# Altium schematic sheet GymkhanaStoper v1.6 Main.SchDoc
size A4; Organization: Altium Limited; Address1: L3, 12a Rodborough Rd; Address2: Frenchs Forest; Address3: NSW; Address4: Australia 2086
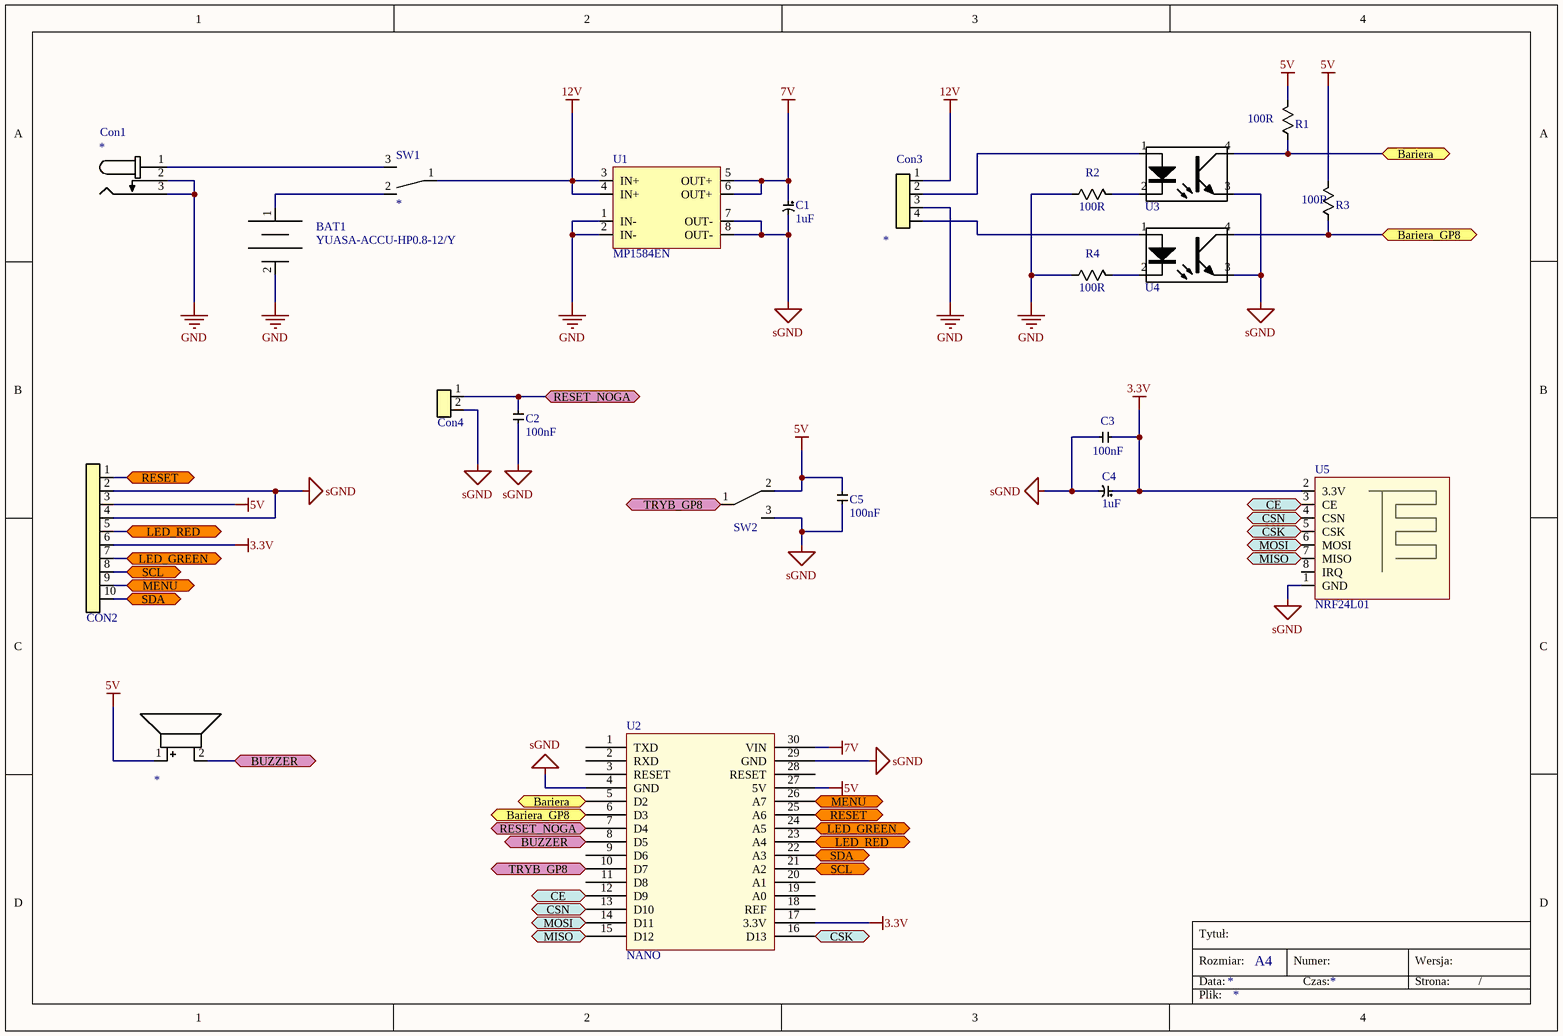
[diagram p0: GymkhanaStoper v1.6 Main.SchDoc]

## Parts
B1  *  [Buzzer F/CM12P]
BAT1  YUASA-ACCU-HP0.8-12/Y  [KK2_4mm_JST]
C1  Pojemność: 1uF  [8x10_SMD]  (hidden comment: *)
C2  Pojemność: 100nF  [0603-C]  (hidden comment: kondensator)
C3  Pojemność: 100nF  [0603-C]  (hidden comment: kondensator)
C4  Pojemność: 1uF  [8x10_SMD]  (hidden comment: *)
C5  Pojemność: 100nF  [0603-C]  (hidden comment: kondensator)
Con1  *  [PowerJack2.5_THT]
CON2  *  [IDC10_2.54mm_SMT]  (value not drawn)
Con3  *  [KK4_2.54mm 90DEG]
Con4  *  [KK2_4mm_JST]  (value not drawn)
R1  Rezystancja: 100R  [1206-R]  (hidden comment: rezystor)
R2  Rezystancja: 100R  [1206-R]  (hidden comment: rezystor)
R3  Rezystancja: 100R  [1206-R]  (hidden comment: rezystor)
R4  Rezystancja: 100R  [1206-R]  (hidden comment: rezystor)
SW1  *  [DPDT - SL13212c]
SW2  *  [DPDT - SL13212c]  (value not drawn)
U1  MP1584EN  [MP1584EN]
U2  NANO  [Arduino nano]
U3  *  [SOP4]  (value not drawn)
U4  *  [SOP4]  (value not drawn)
U5  NRF24L01  [NRF24L01]

## Ports
Bariera, Bariera_GP8, BUZZER, CE, CSK, CSN, LED_GREEN, LED_RED, MENU, MISO, MOSI, RESET, RESET_NOGA, SCL, SDA, TRYB_GP8

## Nets
3.3V: C3.2 C4.1 CON2.6 U2.17(3.3V) U5.2(3.3V)
5V: B1.1 C5.2 CON2.3 R1.2 R3.2 SW2.2 U2.27(5V)
7V: C1.1 U1.5(OUT+) U1.6(OUT+) U2.30(VIN)
12V: Con3.1 SW1.1 U1.3(IN+) U1.4(IN+)
GND: BAT1.2 Con1.2 Con1.3 Con3.3 R2.1 R4.1 U1.1(IN-) U1.2(IN-)
sGND: C1.2 C2.1 C3.1 C4.2 C5.1 CON2.2 CON2.4 Con4.2 SW2.3 U1.7(OUT-) U1.8(OUT-) U2.4(GND) U2.29(GND) U3.3 U4.3 U5.1(GND)
Bariera: R1.1 U2.5(D2) U3.4 ; port Bariera
Bariera_GP8: R3.1 U2.6(D3) U4.4 ; port Bariera_GP8
BUZZER: B1.2 U2.8(D5) ; port BUZZER
CE: U2.12(D9) U5.3(CE) ; port CE
CSK: U2.16(D13) U5.5(CSK) ; port CSK
CSN: U2.13(D10) U5.4(CSN) ; port CSN
LED_GREEN: CON2.7 U2.24(A5) ; port LED_GREEN
LED_RED: CON2.5 U2.23(A4) ; port LED_RED
MENU: CON2.9 U2.26(A7) ; port MENU
MISO: U2.15(D12) U5.7(MISO) ; port MISO
MOSI: U2.14(D11) U5.6(MOSI) ; port MOSI
RESET: CON2.1 U2.25(A6) ; port RESET
RESET_NOGA: C2.2 Con4.1 U2.7(D4) ; port RESET_NOGA
SCL: CON2.8 U2.21(A2) ; port SCL
SDA: CON2.10 U2.22(A3) ; port SDA
TRYB_GP8: SW2.1 U2.10(D7) ; port TRYB_GP8
NetBAT1_1: BAT1.1(+) SW1.2
NetCon1_1: Con1.1 SW1.3
NetCon3_2: Con3.2 U3.1
NetCon3_4: Con3.4 U4.1
NetR2_2: R2.2 U3.2
NetR4_2: R4.2 U4.2

Not connected (* = marked no-connect by the designer): U2 1(TXD) 2(RXD) 3(RESET) 9(D6) 11(D8) 18(REF) 19(A0) 20(A1) 28(RESET); U5 8(IRQ)

## Notes on the sheet
- Tytuł:
- Rozmiar:
- Data:
- A4
- Numer:
- Czas:
- Wersja:
- Strona:
- /
- Plik:

## Library data of the parts
B1 = Buzzer
C1 C4 = C+: Napięcie: 100V
C2 C3 C5 = C: Napięcie: 100V
Con1 = FCR681465P
CON2 = IDC10_2.54mm
Con3 = NS25-W4P-2.54mm
Con4 = Con2
R1-R4 = R: Moc: 1/2 W
SW1 = SP3T ON-OFF-ON: 5MS3S102AM6QE
SW2 = SPDT ON-ON: 5MS1S102AM6QE
U3 U4 = PC817